# EAGLE design RFM69 USB Gateway 0.92 (EAGLE 7.7.0)
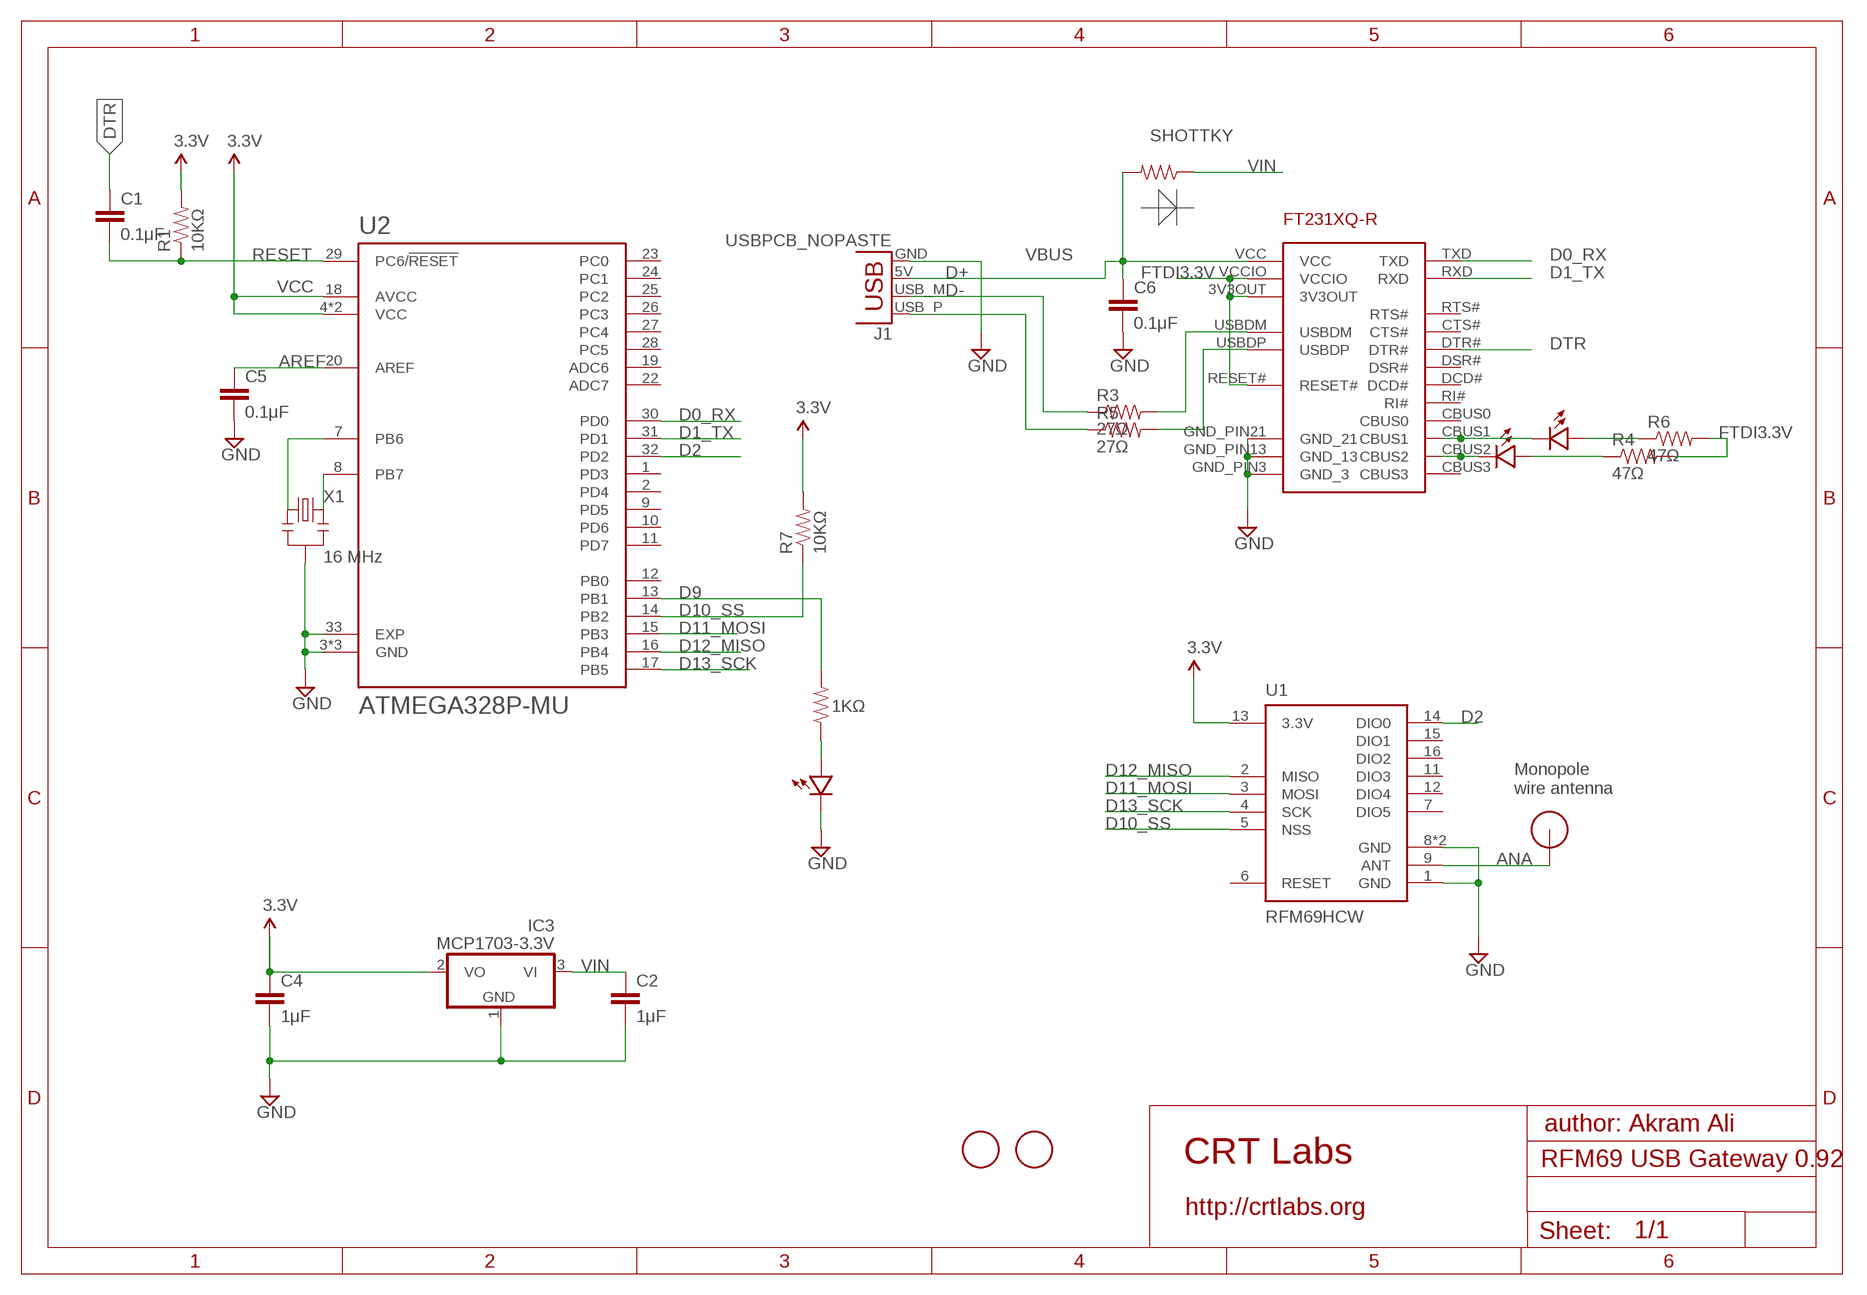
[diagram p0: schematic, sheet 1]

## Parts
C1  0.1μF  CAP0805  [0805]
C2  1μF  CAP0805  [0805]
C4  1μF  CAP0805  [0805]
C5  0.1μF  CAP0805  [0805]
C6  0.1μF  CAP0805  [0805]
D  SHOTTKY  RESISTOR0805  [0805]
FT231XQ-R  FT231XQ-R  [FTDI_FT231XQ-R_PACKAGE]
IC3  MCP1703-3.3V  MCP1703CB  [SOT23]
J1  USBPCB_NOPASTE  [USB-A-PCB-NOPASTE]
R1  10KΩ  RESISTOR0805  [0805]
R2  1KΩ  RESISTOR0805-RES  [0805]
R3  27Ω  RESISTOR0805-RES  [0805]
R4  47Ω  RESISTOR0805-RES  [0805]
R5  27Ω  RESISTOR0805-RES  [0805]
R6  47Ω  RESISTOR0805-RES  [0805]
R7  10KΩ  RESISTOR0805-RES  [0805]
RX  Green  LED0805  [0805-LED]
TX  Red  LED0805  [0805-LED]
U1  RFM69HCW  [RFM69HCW-XXXS2]
U2  ATMEGA328P-MU  [QFN50P500X500X100-33N]
U$2  Status  LED0805  [0805-LED]
U$3  FIDUCIAL  [FIDUCIAL_1MM]
U$4  FIDUCIAL  [FIDUCIAL_1MM]
U$6  RFM12B_ANTENNA  [RFM12B-ANTENNA]
X1  16 MHz  RESONATORSMD  [RESONATOR-SMD]

## Nets
ANA: U1.9(ANT) U$6.P$1
AREF: C5.1 U2.20(AREF)
D0_RX: FT231XQ-R.TXD U2.30(PD0)
D1_TX: FT231XQ-R.RXD U2.31(PD1)
D2: U1.14(DIO0) U2.32(PD2)
D9: R2.2 U2.13(PB1)
D10_SS: R7.1 U1.5(NSS) U2.14(PB2)
D11_MOSI: U1.3(MOSI) U2.15(PB3)
D12_MISO: U1.2(MISO) U2.16(PB4)
D13_SCK: U1.4(SCK) U2.17(PB5)
D+: J1.USB_P(D+) R5.1
D-: J1.USB_M(D-) R3.1
DTR: C1.1 FT231XQ-R.DTR#
FTDI3.3V: FT231XQ-R.3V3OUT FT231XQ-R.RESET# FT231XQ-R.VCCIO R4.2 R6.2
GND [power]: C2.2 C4.2 C5.2 C6.2 FT231XQ-R.GND_PIN3(GND_3) FT231XQ-R.GND_PIN13(GND_13) FT231XQ-R.GND_PIN21(GND_21) IC3.1(GND) J1.GND U1.1(GND) U1.8(GND) U1.10(GND) U2.3(GND) U2.5(GND) U2.21(GND) U2.33(EXP) U$2.MINUS X1.2
N$1: U2.7(PB6) X1.1
N$2: R2.1 U$2.PLUS
N$4: FT231XQ-R.USBDM R3.2
N$5: FT231XQ-R.USBDP R5.2
N$6: FT231XQ-R.CBUS1 RX.MINUS
N$7: FT231XQ-R.CBUS2 TX.MINUS
N$8: R4.1 TX.PLUS
N$9: R6.1 RX.PLUS
N$21: U2.8(PB7) X1.3
RESET: C1.2 R1.1 U2.29(PC6/!RESET)
VBUS [power]: C6.1 D.2 FT231XQ-R.VCC J1.5V(VBUS)
VCC: C4.1 IC3.2(VO) R1.2 R7.2 U1.13(3.3V) U2.4(VCC) U2.6(VCC) U2.18(AVCC) ; supply symbol labelled 3.3V
VIN: C2.1 D.1 IC3.3(VI)
Unconnected: FT231XQ-R.CBUS0 FT231XQ-R.CBUS3 FT231XQ-R.CTS# FT231XQ-R.DCD# FT231XQ-R.DSR# FT231XQ-R.RI# FT231XQ-R.RTS# U1.6(RESET) U1.7(DIO5) U1.11(DIO3) U1.12(DIO4) U1.15(DIO1) U1.16(DIO2) U2.1(PD3) U2.2(PD4) U2.9(PD5) U2.10(PD6) U2.11(PD7) U2.12(PB0) U2.19(ADC6) U2.22(ADC7) U2.23(PC0) U2.24(PC1) U2.25(PC2) U2.26(PC3) U2.27(PC4) U2.28(PC5)

## Notes on the sheet
- Monopole
  wire antenna
- author: Akram Ali
- CRT Labs
- http://crtlabs.org

## Library data of the parts
C1 C5 C6 = SparkFun:CAP: Capacitor Standard 0603 ceramic capacitor, and 0.1" leaded capacitor.; MPN: CC0805KRX7R9BB104
C2 = SparkFun:CAP: Capacitor Standard 0603 ceramic capacitor, and 0.1" leaded capacitor.; MPN: CC0805ZRY5V8BB105
C4 = LowPowerLab:CAP: Capacitor Standard 0603 ceramic capacitor, and 0.1" leaded capacitor.; MPN: CC0805ZRY5V8BB105
D = LowPowerLab:RESISTOR: Resistor Basic schematic elements and footprints for 0603, 1206, and PTH resistors.; MPN: SD0805S040S0R5
FT231XQ-R = ftdi_ft231xq-r:FT231XQ-R: This is the 20-LD QFN package of the FTDI FT231XQ-R chip.; MPN: FT231XQ-R
IC3 = linear:MCP1703: 250 mA, 16V, Low Quiescent Current LDO Regulator Source: http://ww1.microchip.com/downloads/en/DeviceDoc/22049b.pdf; MPN: MCP1703T-2502E/CB
J1 = SparkFun-Connectors:USB: USB Connectors USB-B-PTH is fully proven SKU : PRT-00139/CONN-08278 USB-miniB is fully proven SKU : PRT-00587 USB-A-PCB is untested. USB-A-H is throughly reviewed, but untested. Spark Fun Electronics SKU : PRT-00437 USB-B-SMT is throughly reviewed, but untested. Needs silkscreen touching up. USB-A-S has not been used/tested USB-MB-H has not been used/tested USB-MICROB has been used. CONN-09505
R1 = LowPowerLab:RESISTOR: Resistor Basic schematic elements and footprints for 0603, 1206, and PTH resistors.; MPN: RC0805FR-0710KL
R2 = SparkFun:RESISTOR: Resistor Basic schematic elements and footprints for 0603, 1206, and PTH resistors.; MPN: RC0805FR-071KL
R3 R5 = SparkFun:RESISTOR: Resistor Basic schematic elements and footprints for 0603, 1206, and PTH resistors.; MPN: RC0805FR-0727RL
R4 R6 = SparkFun:RESISTOR: Resistor Basic schematic elements and footprints for 0603, 1206, and PTH resistors.; MPN: RC0805FR-0747RL
R7 = SparkFun:RESISTOR: Resistor Basic schematic elements and footprints for 0603, 1206, and PTH resistors.; MPN: RC0805FR-0710KL
RX TX U$2 = LowPowerLab:LED; MPN: LG R971-KN-1
U1 = SparkFun-RF:RFM69H; MPN: RFM69HW; PROD_ID: IC-11997, IC-12053
U2 = ATMEGA328P-MU:ATMEGA328P-MU: ATmega Series 20 MHz 32 KB Flash 2 KB SRAM 8-Bit Microcontroller - QFN-32; AVAILABILITY: Good; DESCRIPTION: ATmega Series 20 MHz 32 KB Flash 2 KB SRAM 8-Bit Microcontroller - QFN-32; MF: Atmel; MP: ATMEGA328P-MU; MPN: ATMEGA328PB-AU; PACKAGE: QFN-32 Atmel; PRICE: 2.55 USD
U$3 U$4 = adafruit:FIDUCIAL: For use by pick and place machines to calibrate the vision/machine, 1mm By microbuilder.eu
U$6 = LowPowerLab:RFM12B_ANTENNA
X1 = SparkFun:RESONATOR: Resonator Small SMD resonator. This is the itty bitty 10/20MHz resonators with built in caps. CSTCE10M0G55 and CSTCE20M0V53. Footprint has been reviewed closely but hasn't been tested yet.; MPN: CSTCE16M0V53-R0

## Net classes
1 power: width 0.381 mm, clearance 0.254 mm

## Board
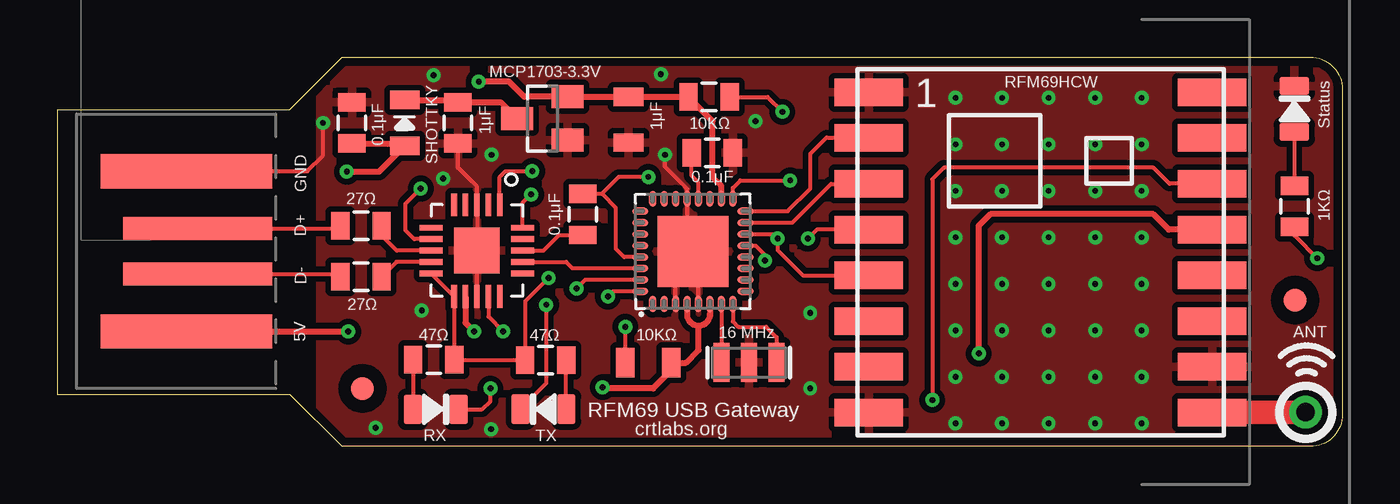
[diagram p1: board, top side]
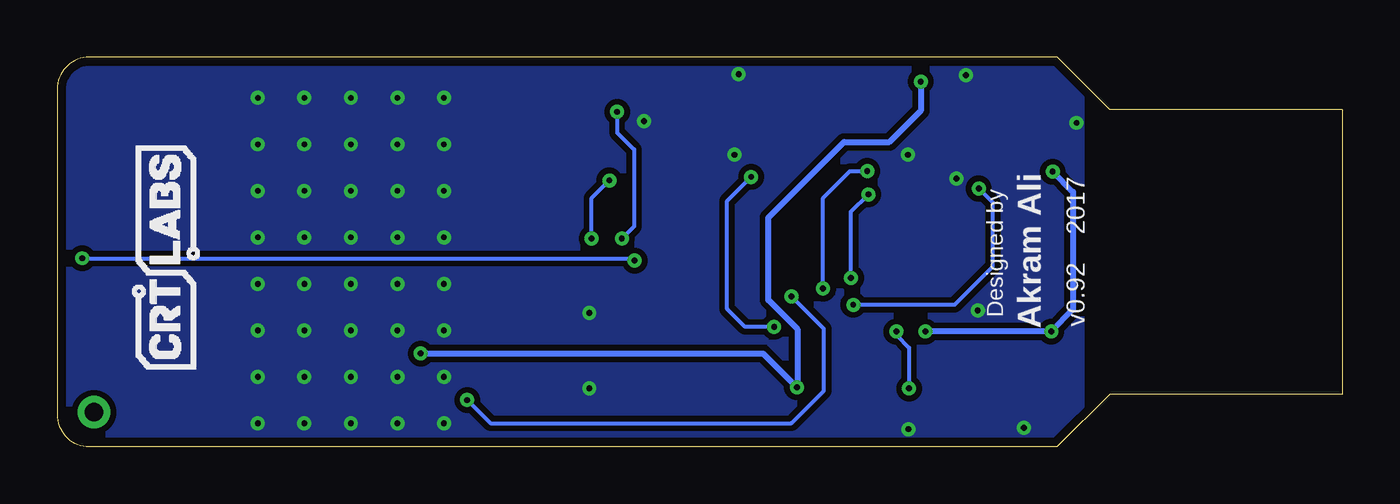
[diagram p2: board, bottom side, seen from below]

Size 56.13 x 17.02 mm. Coordinates in mm from the lower left corner, seen from the top.
Outline: 0,2.29 10.16,2.29 12.45,0 54.74,0 arc90 56.13,1.4 56.13,15.62 arc90 54.74,17.02 12.45,17.02 10.16,14.73 0,14.73 0,2.29
Copper layers (1*16): Top 0.0356mm / dielectric 1.5011mm / Bottom 0.0356mm
Design rules "oshpark-2layer": minimum track width 6mil, minimum drill 13mil, track to track 6mil, track to pad 6mil, pad to pad 6mil, via to via 6mil, smd to smd 6mil, copper to edge 15mil, drill to drill 6mil, minimum pad ring 7mil, minimum via ring 7mil, stop-mask expansion 2.5mil, vias tented up to drill 0mil, thermal gap 10mil

### Footprints (pad centres in the part's own frame; a part is rotated, then mirrored left to right if it is on the bottom)
0805 = smd 0.8 x 1.2: 1 -0.9,0; 2 0.9,0
0805' = smd 0.8 x 1.3: 1 -1,0; 2 1,0
FTDI_FT231XQ-R_PACKAGE = smd 0.25 x 1: 3V3OUT 0.968,-2.032; CBUS2 -0.532,-2.032; CBUS3 0.968,1.968; CTS# -1.032,-2.032; DTR# -0.032,1.968; RTS# -0.532,1.968; TXD 0.468,1.968; USBDM 0.468,-2.032; USBDP -0.032,-2.032; VCCIO -1.032,1.968 | smd 1 x 0.25: CBUS0 1.968,0.968; CBUS1 1.968,0.468; DCD# -2.032,-1.032; DSR# -2.032,-0.532; GND_PIN3 -2.032,-0.032; GND_PIN13 1.968,-0.032; RESET# 1.968,-1.032; RI# -2.032,0.468; RXD -2.032,0.968; VCC 1.968,-0.532 | smd 2 x 2: GND_PIN21 -0.032,-0.032
SOT23 = smd 1 x 1.4: 1 -0.95,-1.1; 2 0.95,-1.1; 3 0,1.1
USB-A-PCB-NOPASTE = smd 7.5 x 1.5: 5V -0.2,-3.5; GND -0.2,3.5 | smd 6.5 x 1: USB_M 0.3,-1; USB_P 0.3,1
0805-LED = smd 0.8 x 1.3: MINUS -1,0; PLUS 1,0
RFM69HCW-XXXS2 = smd 3 x 1.2: 1 -7.5,7; 2 -7.5,5; 3 -7.5,3; 4 -7.5,1; 5 -7.5,-1; 6 -7.5,-3; 7 -7.5,-5; 8 -7.5,-7; 9 7.5,-7; 10 7.5,-5; 11 7.5,-3; 12 7.5,-1; 13 7.5,1; 14 7.5,3; 15 7.5,5; 16 7.5,7
QFN50P500X500X100-33N = smd 0.7 x 0.3: 1 -2.3,1.75; 2 -2.3,1.25; 3 -2.3,0.75; 4 -2.3,0.25; 5 -2.3,-0.25; 6 -2.3,-0.75; 7 -2.3,-1.25; 8 -2.3,-1.75; 17 2.3,-1.75; 18 2.3,-1.25; 19 2.3,-0.75; 20 2.3,-0.25; 21 2.3,0.25; 22 2.3,0.75; 23 2.3,1.25; 24 2.3,1.75 | smd 0.3 x 0.7: 9 -1.75,-2.3; 10 -1.25,-2.3; 11 -0.75,-2.3; 12 -0.25,-2.3; 13 0.25,-2.3; 14 0.75,-2.3; 15 1.25,-2.3; 16 1.75,-2.3; 25 1.75,2.3; 26 1.25,2.3; 27 0.75,2.3; 28 0.25,2.3; 29 -0.25,2.3; 30 -0.75,2.3; 31 -1.25,2.3; 32 -1.75,2.3 | smd 3.1 x 3.1: 33 0,0
FIDUCIAL_1MM = smd 1 x 1: 1 0,0
RFM12B-ANTENNA = drill 0.8 pad 1.422: P$1 0,0
RESONATOR-SMD = smd 0.7 x 1.7: 1 -1.2,0; 2 0,0; 3 1.2,0

### Placement (x,y rotation side)
C1  22.96,10.15 90 top
C2  17.5,14.15 270 top
C4  1μF  [0805']  24.96,14.29 270 top
C5  28.61,12.84 0 top
C6  12.88,14.15 90 top
D  SHOTTKY  [0805']  15.19,14.15 270 top
FT231XQ-R  18.36,8.53 270 top
IC3  21.2,14.34 90 top
J1  5.84,8.53 0 top
R1  10KΩ  [0805']  25.82,3.67 0 top
R2  54.05,10.5 270 top
R3  13.27,7.42 0 top
R4  21.34,3.78 180 top
R5  13.27,9.65 0 top
R6  16.45,3.8 0 top
R7  28.47,15.28 180 top
RX  16.54,1.63 180 top
TX  21.23,1.64 0 top
U1  42.95,8.48 0 top
U2  27.76,8.53 90 top
U$2  54.04,14.76 270 top
U$3  13.33,2.54 0 top
U$4  54.08,6.4 0 top
U$6  54.53,1.5 0 top
X1  30.21,3.67 0 top

### Tracks (layer width: path | path; a pad name or v marks a point on that pad's centre or on a via)
ANA
  Top 1.016: U1.9 54.01,1.48 U$6.P$1
AREF
  Top 0.178: U2.20 28.01,11.54 27.71,11.84 C5.1
D0_RX
  Top 0.178: U2.30 22.52,7.78 22.24,8.07 FT231XQ-R.TXD
D1_TX  (via drill 0.25 pad 0.13)
  Top 0.178: U2.31 23.06,7.28 v22.68,6.91 | FT231XQ-R.RXD 19.33,11.79 19.58,12.04 v20.75,12.04
  Bottom 0.178: v22.68,6.91 22.68,10.87 21.51,12.04 v20.75,12.04
D2  (via drill 0.25 pad 0.13)
  Top 0.178: U2.32 24.28,6.78 v24.05,6.55 | U1.14 48.59,11.48 47.88,12.19 38.73,12.19 38.23,11.68 v38.23,2.03
  Bottom 0.178: v24.05,6.55 22.64,5.14 22.64,2.44 24.07,1.02 37.21,1.02 v38.23,2.03
D9  (via drill 0.25 pad 0.13)
  Top 0.178: U2.13 30.51,8.78 30.91,8.38 v30.91,8.13 | R2.2 54.05,9.22 v55.04,8.23
  Bottom 0.178: v55.04,8.23 31.01,8.23 v30.91,8.13
D10_SS  (via drill 0.25 pad 0.13)
  Top 0.178: U1.5 32.57,7.48 31.47,8.58 v31.47,9.09 31.28,9.28 U2.14 | R7.1 31.03,15.28 v31.67,14.63
  Bottom 0.178: v31.67,14.63 31.67,13.72 30.94,12.98 30.94,9.63 v31.47,9.09
D11_MOSI
  Top 0.178: U1.3 33.81,11.48 32.11,9.78 U2.15
D12_MISO
  Top 0.178: 35.42,13.51 U1.2 35.42,13.51 | 35.42,13.51 33.6,13.51 32.89,12.8 32.89,11.28 31.9,10.28 U2.16
D13_SCK  (via drill 0.25 pad 0.13)
  Top 0.178: U1.4 33.18,9.48 v32.79,9.09 | U2.17 29.51,11.3 29.84,11.63 v32.02,11.63
  Bottom 0.178: v32.79,9.09 32.79,10.87 32.03,11.63 v32.02,11.63
D+
  Top 0.178: R5.1 12.25,9.53 J1.USB_P
D-
  Top 0.178: R3.1 12.25,7.53 J1.USB_M
DTR
  Top 0.178: FT231XQ-R.DTR# 21.24,8.57 21.92,9.25 C1.1
FTDI3.3V  (via drill 0.25 pad 0.13)
  Top 0.178: R6.2 20.42,3.8 R4.2 20.45,3.8 20.45,6.35 v21.46,7.37 | 17.33,3.81 R6.2 | FT231XQ-R.VCCIO 20.33,10.65 v20.7,11.02 | FT231XQ-R.3V3OUT FT231XQ-R.RESET# 17.33,3.81 | 17.33,3.81 R6.2
  Bottom 0.178: v21.46,7.37 21.46,10.26 v20.7,11.02
GND  (via drill 0.25 pad 0.13)
  Top 0.178: FT231XQ-R.GND_PIN13 FT231XQ-R.GND_PIN21 FT231XQ-R.GND_PIN3 18.33,11.36 17.5,12.19 C2.2 | U2.33 27.51,8.78 U2.21 27.51,11.27 26.54,12.24 v26.54,12.75 | U2.3 27.01,7.78 U2.33 | J1.GND 10.92,12.03 11.61,12.72 v11.61,14.15 | U2.5 28.01,8.28 U2.33
  other vias: 18.97,12.75 15.93,5.94 26.37,16.28 16.43,16.23 13.91,0.81 18.95,0.76 16.85,11.71 30.51,14.22 45.34,5.08 43.31,1.02 43.31,3.05 43.31,5.08 43.31,7.11 45.34,7.11 41.27,1.02 47.37,5.08 47.37,7.11 45.34,3.05 47.37,3.05 43.31,9.14 43.31,11.18 43.31,13.21 43.31,15.24 45.34,9.14 45.34,11.18 45.34,13.21 45.34,15.24 47.37,15.24 47.37,13.21 47.37,11.18 47.37,9.14 47.37,1.02 45.34,1.02 41.27,13.21 39.24,13.21 39.24,15.24 41.27,15.24 41.27,11.18 39.24,11.18 39.24,9.14 41.27,9.14 41.27,7.11 39.24,7.11 39.24,5.08 41.27,5.08 41.27,3.05 39.24,3.05 39.24,1.02 32.89,2.54 32.89,5.84
  pour Bottom: 11.43,16.89 11.43,-0.13 70.57,-0.32 70.57,16.7
  pour Top: 11.48,16.85 11.48,-0.17 70.54,-0.32 70.54,16.7
N$1
  Top 0.178: U2.7 X1.1
N$2
  Top 0.178: U$2.PLUS 54.04,11.42 R2.1
N$4
  Top 0.178: FT231XQ-R.USBDM 14.82,8.07 R3.2
N$5
  Top 0.178: FT231XQ-R.USBDP 14.83,8.57 14.17,9.22 R5.2
N$6  (via drill 0.25 pad 0.13)
  Top 0.178: FT231XQ-R.CBUS1 18.83,5.68 v19.48,5.03 | RX.MINUS 18.57,1.63 18.92,1.98 v18.92,2.54
  Bottom 0.178: v19.48,5.03 19.48,4.88 18.92,4.32 v18.92,2.54
N$7  (via drill 0.25 pad 0.13)
  Top 0.178: TX.MINUS 21.36,2.76 v21.36,6.2 | v15.87,11.28 15.21,10.62 15.21,9.45 15.6,9.07 FT231XQ-R.CBUS2
  Bottom 0.178: v21.36,6.2 16.94,6.2 15.26,7.87 15.26,10.67 v15.87,11.28
N$8
  Top 0.178: TX.PLUS R4.1
N$9
  Top 0.178: R6.1 15.55,1.64 RX.PLUS
N$21
  Top 0.178: U2.8 29.51,5.46 29.74,5.23 30.96,5.23 31.42,4.78 X1.3
RESET  (via drill 0.25 pad 0.13)
  Top 0.178: U2.29 24.76,8.28 24.4,8.65 24.4,10.44 23.79,11.05 | C1.2 23.79,11.05 | R1.1 v24.82,5.23 | v25.82,11.79 24.53,11.79 23.79,11.05
  Bottom 0.178: v24.82,5.23 26.09,5.23 26.87,6.02 26.87,10.73 v25.82,11.79
VBUS  (via drill 0.25 pad 0.13)
  Top 0.178: D.2 15.09,13.25 | J1.5V
  Top 0.254: C6.1 15.09,13.25 | FT231XQ-R.VCC 17.83,5.41 v18.21,5.03 | J1.5V v12.71,5.03 | v12.65,12.01 14.06,12.01 D.2
  Bottom 0.254: v18.21,5.03 v12.71,5.03 11.76,5.98 11.76,11.12 v12.65,12.01
VCC  (via drill 0.25 pad 0.13)
  Top 0.178: C4.1 | R1.2 26.83,3.66 | 28.51,5.78 U2.6
  Top 0.254: C4.1 IC3.2 20.4,15.29 19.74,15.95 v18.41,15.95 | U2.18 29.01,11.4 28.63,11.79 28.63,14.23 R7.2 C4.1 | U2.4 27.51,5.79 arc90 28.02,5.28 | 28.02,5.28 arc90 28.51,5.78 | 28.02,5.28 28.02,4.22 27.46,3.66 26.83,3.66 | U2.6 28.51,5.68 | 50.41,9.53 U1.13 48.55,9.48 47.88,10.16 40.77,10.16 40.26,9.65 v40.26,4.06 | R1.2 26.82,3.32 26.03,2.54 23.88,2.54 v23.83,2.59
  Bottom 0.254: v18.41,15.95 18.41,14.68 19.79,13.31 21.77,13.31 25.07,10.01 25.07,6.4 23.8,5.13 23.8,2.62 v23.83,2.59 25.3,4.06 v40.26,4.06
VIN
  Top 0.178: 17.4,15.15 C2.1
  Top 0.254: D.1 17.4,15.15 | C2.1 19.39,15.05 IC3.3

### Text on the board
tPlace: ANT | RFM69 USB Gateway | crtlabs.org
bPlace: v0.92 2017 | Akram Ali | Designed by
tDocu: All dimensions in mils | Moteino-USB
_tsilk: GND | D+ | D- | 5V